# Altium schematic sheet STM32f103c8t6.SchDoc
size A4; SheetNumber: 2; SheetTotal: 5
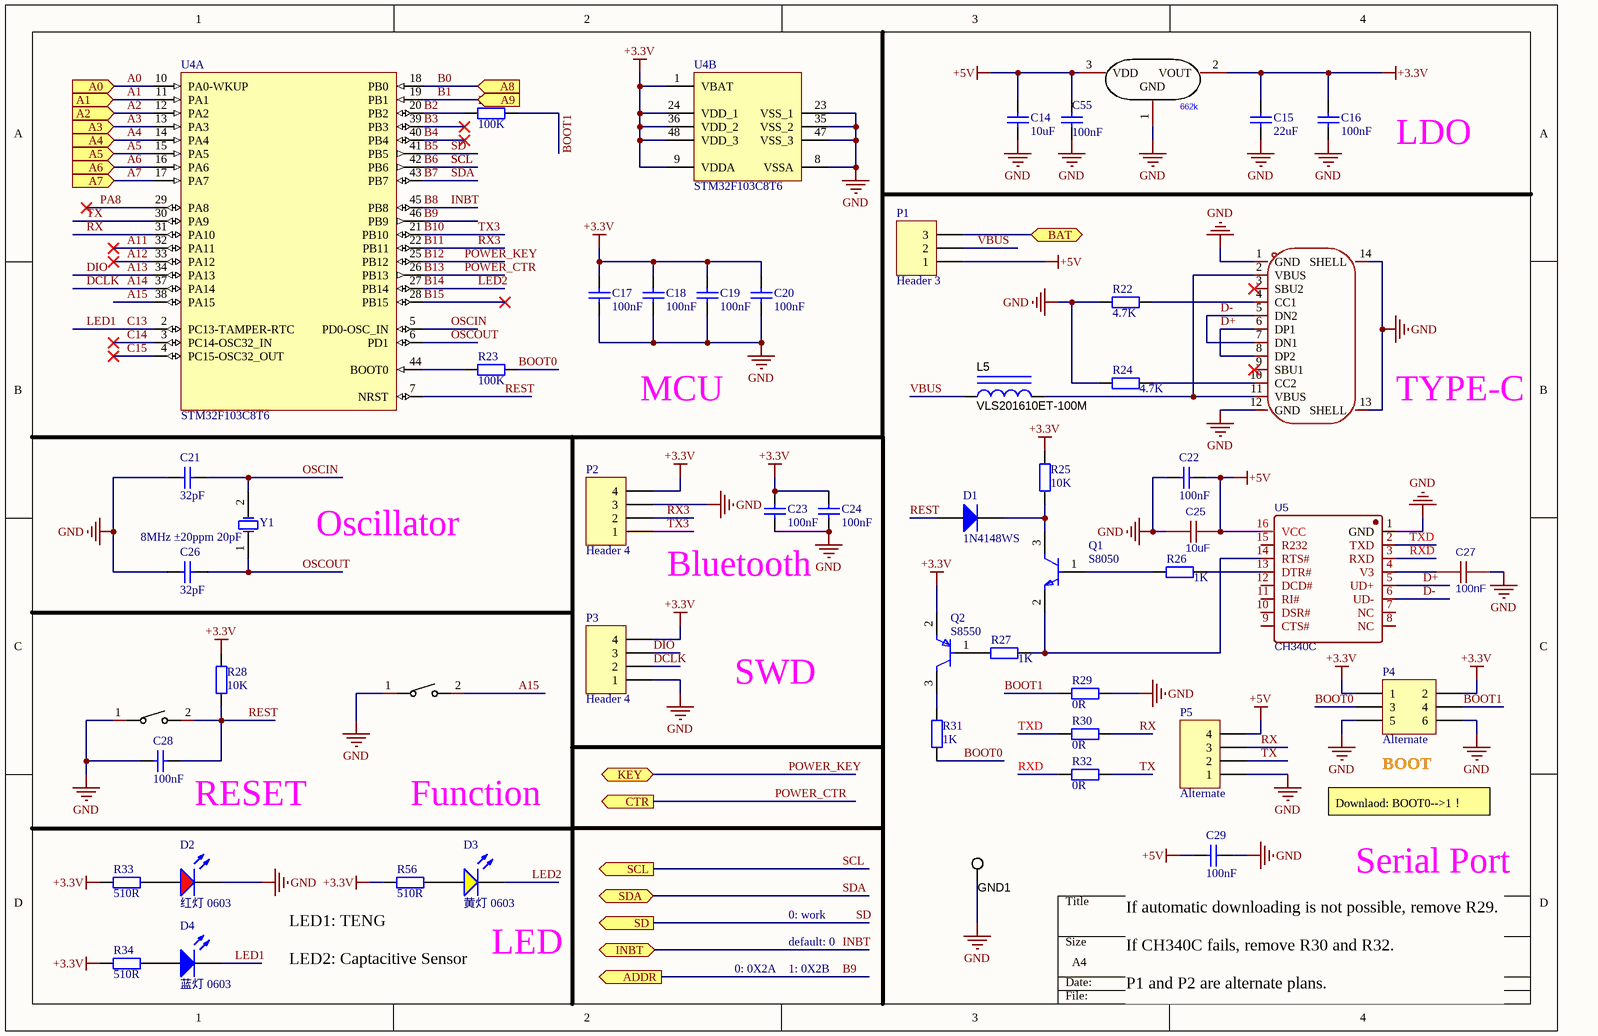
[diagram p0: STM32f103c8t6.SchDoc]

## Parts
C14  10uF  [0603]
C15  22uF  [0603]
C16  100nF  [0402_C]
C17  100nF  [0402_C]
C18  100nF  [0402_C]
C19  100nF  [0402_C]
C20  100nF  [0402_C]
C21  32pF  [0402_C]
C22  100nF  [0402_C]
C23  100nF  [0402_C]
C24  100nF  [0402_C]
C25  10uF  [0402_C]
C26  32pF  [0402_C]
C27  100nF  [0402_C]
C28  100nF  [0402_C]
C29  100nF  [0402_C]
C55  100nF  [0402_C]
D1  1N4148WS  [SOD-323]
D2  红灯 0603  [0603_LED_S1]
D3  黄灯 0603  [0603_LED_S1]
D4  蓝灯 0603  [0603_LED_S1]
GND1  5015  [Testpoint_Keystone_Miniature]  (value not drawn)
L5  VLS201610ET-100M  [VLS201610ET]
LDO1  662k  [SOT-23-3_L2.9-W1.3-P1.90-LS2.4-BR]
P1  Header 3  [SIP-3]
P2  Header 4  [XH254-4]
P3  Header 4  [SIP-4]
P4  Alternate  [HDR2X3 - SMT]
P5  Alternate  [SIP-4]
Q1  S8050  [FP-SS8050-G-IPC_B]
Q2  S8550  [FP-SOT-23-IPC_A]
R21  100K  [0402_R]
R22  4.7K  [0402_R]
R23  100K  [0402_R]
R24  4.7K  [0402_R]
R25  10K  [0402_R]
R26  1K  [0402_R]
R27  1K  [0402_R]
R28  10K  [0402_R]
R29  0R  [0805_R]
R30  0R  [0805_R]
R31  1K  [0402_R]
R32  0R  [0805_R]
R33  510R  [0402_R]
R34  510R  [0402_R]
R56  510R  [0402_R]
SW1  TS-1088-AR02016  [SW-SMD_L3.9-W3.0-P4.45]  (value not drawn)
SW2  TS-1088-AR02016  [SW-SMD_L3.9-W3.0-P4.45]  (value not drawn)
U4  STM32F103C8T6  [LQFP-48_7x7x05P]  (parts A,B of 2)
U5  CH340C  [SOP-16_150MIL]
USB1  TYPE-C 16PIN 2MD(073)  [USB-C-SMD_TYPE-C-6PIN-2MD-073]  (value not drawn)
Y1  8MHz ±20ppm 20pF  [SMD-5032_2P]

## Ports
A0 (in, see Insight[2A], TENG[4A]), A1 (in, see Insight[2B], TENG[4A]), A2 (in, see Insight[2B], TENG[4A]), A3 (in, see Insight[2B], TENG[4A]), A4 (in, see Insight[2B], TENG[4A]), A5 (in, see Insight[2B], TENG[4A]), A6 (in, see Insight[2B], TENG[4A]), A7 (in, see Insight[2B], TENG[4B]), A8 (in, see Insight[2B], TENG[4B]), A9 (in, see Insight[2B], TENG[4B]), ADDR (out, see Insight[3B], FDC2214[2A]), BAT (bidir, see Insight[2C], OnOffCircuit[1A], OnOffCircuit[3A]), CTR (out, see Insight[3C], OnOffCircuit[1B]), INBT (bidir, see Insight[3C], FDC2214[2A]), KEY (bidir, see Insight[3C], OnOffCircuit[3B]), SCL (out, see Insight[3A], FDC2214[2A]), SD (out, see Insight[3B], FDC2214[2A]), SDA (bidir, see Insight[3B], FDC2214[2A])

## Nets
+3.3V: C15.1 C16.1 C17.2 C18.2 C19.2 C20.2 C23.2 C24.2 LDO1.2(VOUT) P2.4 P3.4 P4.1 P4.2 Q2.2(E) R25.2 R28.2 R33.2 R34.2 R56.2 U4.1(VBAT) U4.9(VDDA) U4.24(VDD_1) U4.36(VDD_2) U4.48(VDD_3)
+5V: C14.1 C22.2 C25.1 C29.2 C55.2 LDO1.3(VDD) P1.1 P5.4 U5.16(VCC)
GND: C14.2 C15.2 C16.2 C17.1 C18.1 C19.1 C20.1 C21.1 C22.1 C23.1 C24.1 C25.2 C26.1 C27.2 C28.2 C29.1 C55.1 D2.K GND1.1 LDO1.1(GND) P2.3 P3.1 P4.5 P4.6 P5.1 R22.1 R24.1 R29.2 SW1.1 SW2.1 U4.8(VSSA) U4.23(VSS_1) U4.35(VSS_2) U4.47(VSS_3) U5.1(GND) USB1.1(GND) USB1.12(GND) USB1.13(SHELL) USB1.14(SHELL)
A0: U4.10(PA0-WKUP) ; port A0
A1: U4.11(PA1) ; port A1
A2: U4.12(PA2) ; port A2
A3: U4.13(PA3) ; port A3
A4: U4.14(PA4) ; port A4
A5: U4.15(PA5) ; port A5
A6: U4.16(PA6) ; port A6
A7: U4.17(PA7) ; port A7
A11: U4.32(PA11)
A12: U4.33(PA12)
A13: P3.3 U4.34(PA13)  [also labelled DIO]
A14: P3.2 U4.37(PA14)  [also labelled DCLK]
A15: SW1.2 U4.38(PA15)
B0: U4.18(PB0) ; port A8
B1: U4.19(PB1) ; port A9
B2: R21.1 U4.20(PB2)
B3: U4.39(PB3)
B4: U4.40(PB4)
B5: U4.41(PB5) ; port SD  [also labelled SD]
B6: U4.42(PB6) ; port SCL  [also labelled SCL]
B7: U4.43(PB7) ; port SDA  [also labelled SDA]
B8: U4.45(PB8) ; port INBT  [also labelled INBT]
B9: U4.46(PB9) ; port ADDR
B10: P2.1 U4.21(PB10)  [also labelled TX3]
B11: P2.2 U4.22(PB11)  [also labelled RX3]
B12: U4.25(PB12) ; port KEY  [also labelled POWER_KEY]
B13: U4.26(PB13) ; port CTR  [also labelled POWER_CTR]
B14: D3.K U4.27(PB14)  [also labelled LED2]
B15: U4.28(PB15)
BAT: P1.3 ; port BAT
BOOT0: P4.3 R23.2 R31.1
BOOT1: P4.4 R21.2 R29.1
C13: D4.K U4.2(PC13-TAMPER-RTC)  [also labelled LED1]
C14: U4.3(PC14-OSC32_IN)
C15: U4.4(PC15-OSC32_OUT)
D+: U5.5(UD+) USB1.6(DP1) USB1.8(DP2)
D-: U5.6(UD-) USB1.5(DN2) USB1.7(DN1)
OSCIN: C21.2 U4.5(PD0-OSC_IN) Y1.2(OSC2)
OSCOUT: C26.2 U4.6(PD1) Y1.1(OSC1)
PA8: U4.29(PA8)
REST: C28.1 D1.1(A) R28.1 SW2.2 U4.7(NRST)
RX: P5.3 R30.2 U4.31(PA10)
RXD: R32.1 U5.3(RXD)
TX: P5.2 R32.2 U4.30(PA9)
TXD: R30.1 U5.2(TXD)
VBUS: L5.1 P1.2
NetC27_1: C27.1 U5.4(V3)
NetD1_2: D1.2(K) Q1.3(C) R25.1
NetD2_A: D2.A R33.1
NetD3_A: D3.A R56.1
NetD4_A: D4.A R34.1
NetL5_2: L5.2 USB1.2(VBUS) USB1.11(VBUS)
NetQ1_1: Q1.1(B) R26.1
NetQ1_2: Q1.2(E) R27.2 U5.14(RTS#)
NetQ2_1: Q2.1(B) R27.1
NetQ2_3: Q2.3(C) R31.2
NetR22_2: R22.2 USB1.4(CC1)
NetR23_1: R23.1 U4.44(BOOT0)
NetR24_2: R24.2 USB1.10(CC2)
NetR26_2: R26.2 U5.13(DTR#)

Not connected (* = marked no-connect by the designer): U5 7(NC) 8(NC) 9(CTS#) 10(DSR#) 11(RI#) 12(DCD#) 15(R232); USB1 3(SBU2)* 9(SBU1)*

## Notes on the sheet
- LDO
- MCU
- (near USB1) TYPE-C
- Oscillator
- Bluetooth
- SWD
- (near P4) BOOT
- (near C28) RESET
- Function
- Downlaod: BOOT0-->1！
- 0: work
- Serial Port
- LED1: TENG
  LED2: Captacitive Sensor
- (near D3) LED
- 0: 0X2A
- default: 0
- 1: 0X2B
- (near C29) If automatic downloading is not possible, remove R29.
  If CH340C fails, remove R30 and R32.
  P1 and P2 are alternate plans.

## Library data of the parts
C14-C24 C26 C28 C29 C55 = Cap_0402: 0402贴片电容; Package: 0402; 常见贴片电容尺寸图: https://wenku.baidu.com/view/21d5206100f69e3143323968011ca300a6c3f6b2.html
C25 C27 = C: BOM_Manufacturer: SEIKO; BOM_Manufacturer Part: XH414HG-IV01E; nameAlias: Capacitance; BOM_Supplier: LCSC; BOM_Supplier Part: C38065; spicePre: C; spiceSymbolName: XH414HG-IV01E
D1 = 1N4148WS_SOD-323: 二极管; ComponentLink1Description: 供应商链接; ComponentLink1URL: http://www.szlcsc.com/product/details_2485.html; Package: SOD-323; Supplier: LC; SuppliersPartNumber: C2128
D2 = 0603 红灯: 发光二极管; ComponentLink1Description: 供应商链接; ComponentLink1URL: http://www.szlcsc.com/product/details_2659.html; Package: 0603; Supplier: LC; SuppliersPartNumber: C2286
D3 = 0603 黄灯: 发光二极管; ComponentLink1Description: 供应商链接; ComponentLink1URL: http://www.szlcsc.com/product/details_73147.html; Package: 0603; Supplier: LC; SuppliersPartNumber: C72038
D4 = 0603 蓝灯: 发光二极管; ComponentLink1Description: 供应商链接; ComponentLink1URL: http://www.szlcsc.com/product/details_73150.html; Package: 0603; Supplier: LC; SuppliersPartNumber: C72041
GND1 = 5015: Test Point, Miniature, SMT; Manufacturer: Keystone; CompType: Test Point Loop; U/M: EA; SymbolVersion: 2008-07-10; PartNumber: 5015; Value: SMT; PackageReference: Testpoint_Keystone_Miniature; RoHS: Y; MountType: SMT; ComponentLink1Description: Datasheet Link; ComponentLink1URL: http://www.keyelco.com/userAssets/store/files/5015.PDF; Publisher: Texas Instruments; LatestRevisionDate: 2014-09-23; Supplier 1: Digi-Key; Supplier Part Number 1: 5015KCT-ND
L5 = VLS201610ET-100M: Inductor, Shielded, Ferrite, 10 μH, 0.4 A, 1.38 ohm, SMD; Manufacturer: TDK; Value: 10uH; Ind_H: 10.0E-6; ValueDisplayed: 10μH; Imax_A: 0.4; Irms: 0.42A @ 40C rise; Isat: 0.4A @ 30% inductance drop; DCR_ohm: 1.38; Value2: 0.4A; SymbolVersion: 2008-07-23; CompType: Inductor; PartNumber: VLS201610ET-100M; Value1: 1.38 ohm; Technology: Shielded; MountType: SMT; Material: Ferrite; PackageReference: 2.0x0.95x1.6mm; Published: 2008-06-26; Publisher: Texas Instruments; LatestRevisionDate: 2015-01-12; ComponentLink1Description: Datasheet link; ComponentLink1URL: http://product.tdk.com/inductor/ind/en/documents/inductor_commercial_power_vls_en.pdf; RoHS: Y; Supplier 1: Digi-Key; Supplier Part Number 1: 445-6608-1-ND; Supplier 2: Mouser; Supplier Part Number 2: 810-VLS201610ET-100M
LDO1 = SC662K-3.3V: Manufacturer: FM(富满); Add into BOM: yes; Output Type: 固定; Maximum Input Voltage: 6V; Output Voltage: 3.3V; MAX Output Current: 250mA; Power Supply Rejection Ratio (PSRR): 50dB@(1kHz); Dropout Voltage: 38mV@(10mA); Output Polarity: 正极; Number of Outputs: 1; Name: SC662K-3.3V; Symbol: SC662K-3.3V; Device: SC662K-3.3V; LCSC Part Name: 输入6V 输出3.3V 250mA 停产 停产; Supplier Part: C83932; Manufacturer Part: SC662K-3.3V; Supplier Footprint: SOT-23; JLCPCB Part Class: Extended Part; Datasheet: https://atta.szlcsc.com/upload/public/pdf/source/20161024/1477288576049.pdf; Supplier: LCSC; Convert to PCB: yes
P1 = Header 3: Header, 3-Pin; LatestRevisionDate: 17-Jul-2002; LatestRevisionNote: Re-released for DXP Platform.; Publisher: Altium Limited
P2 P3 P5 = Header 4: Header, 4-Pin; LatestRevisionDate: 17-Jul-2002; LatestRevisionNote: Re-released for DXP Platform.; Publisher: Altium Limited
P4 = Header 3X2: Header, 3-Pin, Dual row; LatestRevisionDate: 17-Jul-2002; LatestRevisionNote: Re-released for DXP Platform.; Publisher: Altium Limited
Q1 = S8050: NPN TRANSISTOR 1.5A 40V SOT-23 R; Transition Frequency: 100MHz; Max Breakdown Voltage: 25V; Collector Emitter Voltage (VCEO): 400mV; Max Power Dissipation: 300mW; Max Collector Current: 1.5A; Case/Package: TO-236-3; Packaging: Tape and Reel; RoHS Compliant: Yes; Mount: Surface Mount; Collector Emitter Breakdown Voltage: 25V
Q2 = S8550: TRANS PNP 25V 1.5A SOT23; Emitter Base Voltage (VEBO): 1.6V; Collector Base Voltage (VCBO): 40V; Collector Emitter Saturation Voltage: 500mV; Max Power Dissipation: 625mW; Transition Frequency: 100MHz; Element Configuration: Single; hFE Min: 40; Polarity: PNP; Lead Free: Lead Free; Max Breakdown Voltage: 25V; Package Quantity: 1; Min Operating Temperature: -55°C; Case/Package: SOT-23; Max Collector Current: 1.5A; Mount: Surface Mount; Packaging: Tape and Reel; Collector Emitter Voltage (VCEO): 500mV; Max Operating Temperature: 150°C; Gain Bandwidth Product: 100MHz; Collector Emitter Breakdown Voltage: 25V
R21-R28 R33 R34 R56 = Res_0402: 贴片电阻; ComponentLink1Description: 供应商链接; ComponentLink1URL: http://www.szlcsc.com/product/details_17853.html; Package: 0402; Supplier: LC; SuppliersPartNumber: C17168
R29-R32 = Res_0805: 0805贴片电阻; ComponentLink1Description: 供应商链接; ComponentLink1URL: http://www.szlcsc.com/product/details_26856.html; Package: 0805; Supplier: LC; SuppliersPartNumber: C26113
SW1 SW2 = Key: Manufacturer: XUNPU(讯普); Add into BOM: yes; Circuit: 单刀单掷; Actuator Style: 圆形按钮; Operating Force: 160gf; Switch Length: 4mm; Switch Width: 3mm; Switch Height: 2mm; Strike Gundam: 不带; Contact Current: 50mA; Voltage Rating (DC): 12V; Insulation Resistance: 100MΩ; Actuator/Cap Color: 黑色; Pin Style: SMD接片; Mechanical Life: 10万次; Symbol: TS-1088-AR02016; Device: TS-1088-AR02016; Supplier: LCSC; Supplier Part: C720477; Manufacturer Part: TS-1088-AR02016; JLCPCB Part Class: Extended Part; LCSC Part Name: 4*3*2mm 立贴 轻触开关; Supplier Footprint: SMD; Datasheet: https://atta.szlcsc.com/upload/public/pdf/source/20200810/C720475_60D09DD6C54279ADDB2DC25100F1CC11.pdf; Convert to PCB: yes; Mounting Style: 立贴; Operating Temperature: -30℃~+80℃
U4 = STM32F103C8T6: ARM; ComponentLink1Description: 供应商链接; ComponentLink1URL: http://www.szlcsc.com/product/details_9243.html; Package: LQFP-48_7x7x05P; Supplier: LC; SuppliersPartNumber: C8734
U5 = CH340C: BOM_Manufacturer: WCH; BOM_Supplier: LCSC; BOM_Manufacturer Part: CH340C; BOM_Supplier Part: C84681; spicePre: U
USB1 = TYPE-C 16PIN 2MD(073): Manufacturer: SHOU HAN(首韩); Add into BOM: yes; Gender: 母; Number of Ports: 1; Number of Contacts: 16P; Current Rating - Power (Max): 5A; Symbol: TYPE-C 16PIN 2MD(073); Device: TYPE-C 16PIN 2MD(073); LCSC Part Name: Type-C 母 卧贴; Supplier Part: C2765186; Manufacturer Part: TYPE-C 16PIN 2MD(073); Supplier Footprint: SMD; JLCPCB Part Class: Extended Part; Datasheet: https://atta.szlcsc.com/upload/public/pdf/source/20211123/39B17C16241EAC15C5E277BDA434118E.pdf; Supplier: LCSC; Convert to PCB: yes; Connector Type: Type-C; Standard: -; Mounting Style: 卧贴; Operating Temperature Range: -25℃~+85℃
Y1 = SMD-5032_2P 8MHz 20ppm 20pF: 贴片晶振; ComponentLink1Description: 供应商链接; ComponentLink1URL: http://www.szlcsc.com/product/details_19261.html; Package: SMD-5032_2P; Supplier: LC; SuppliersPartNumber: C18560